# EAGLE design Laser_Array_Charging_board (EAGLE 7.7.0)
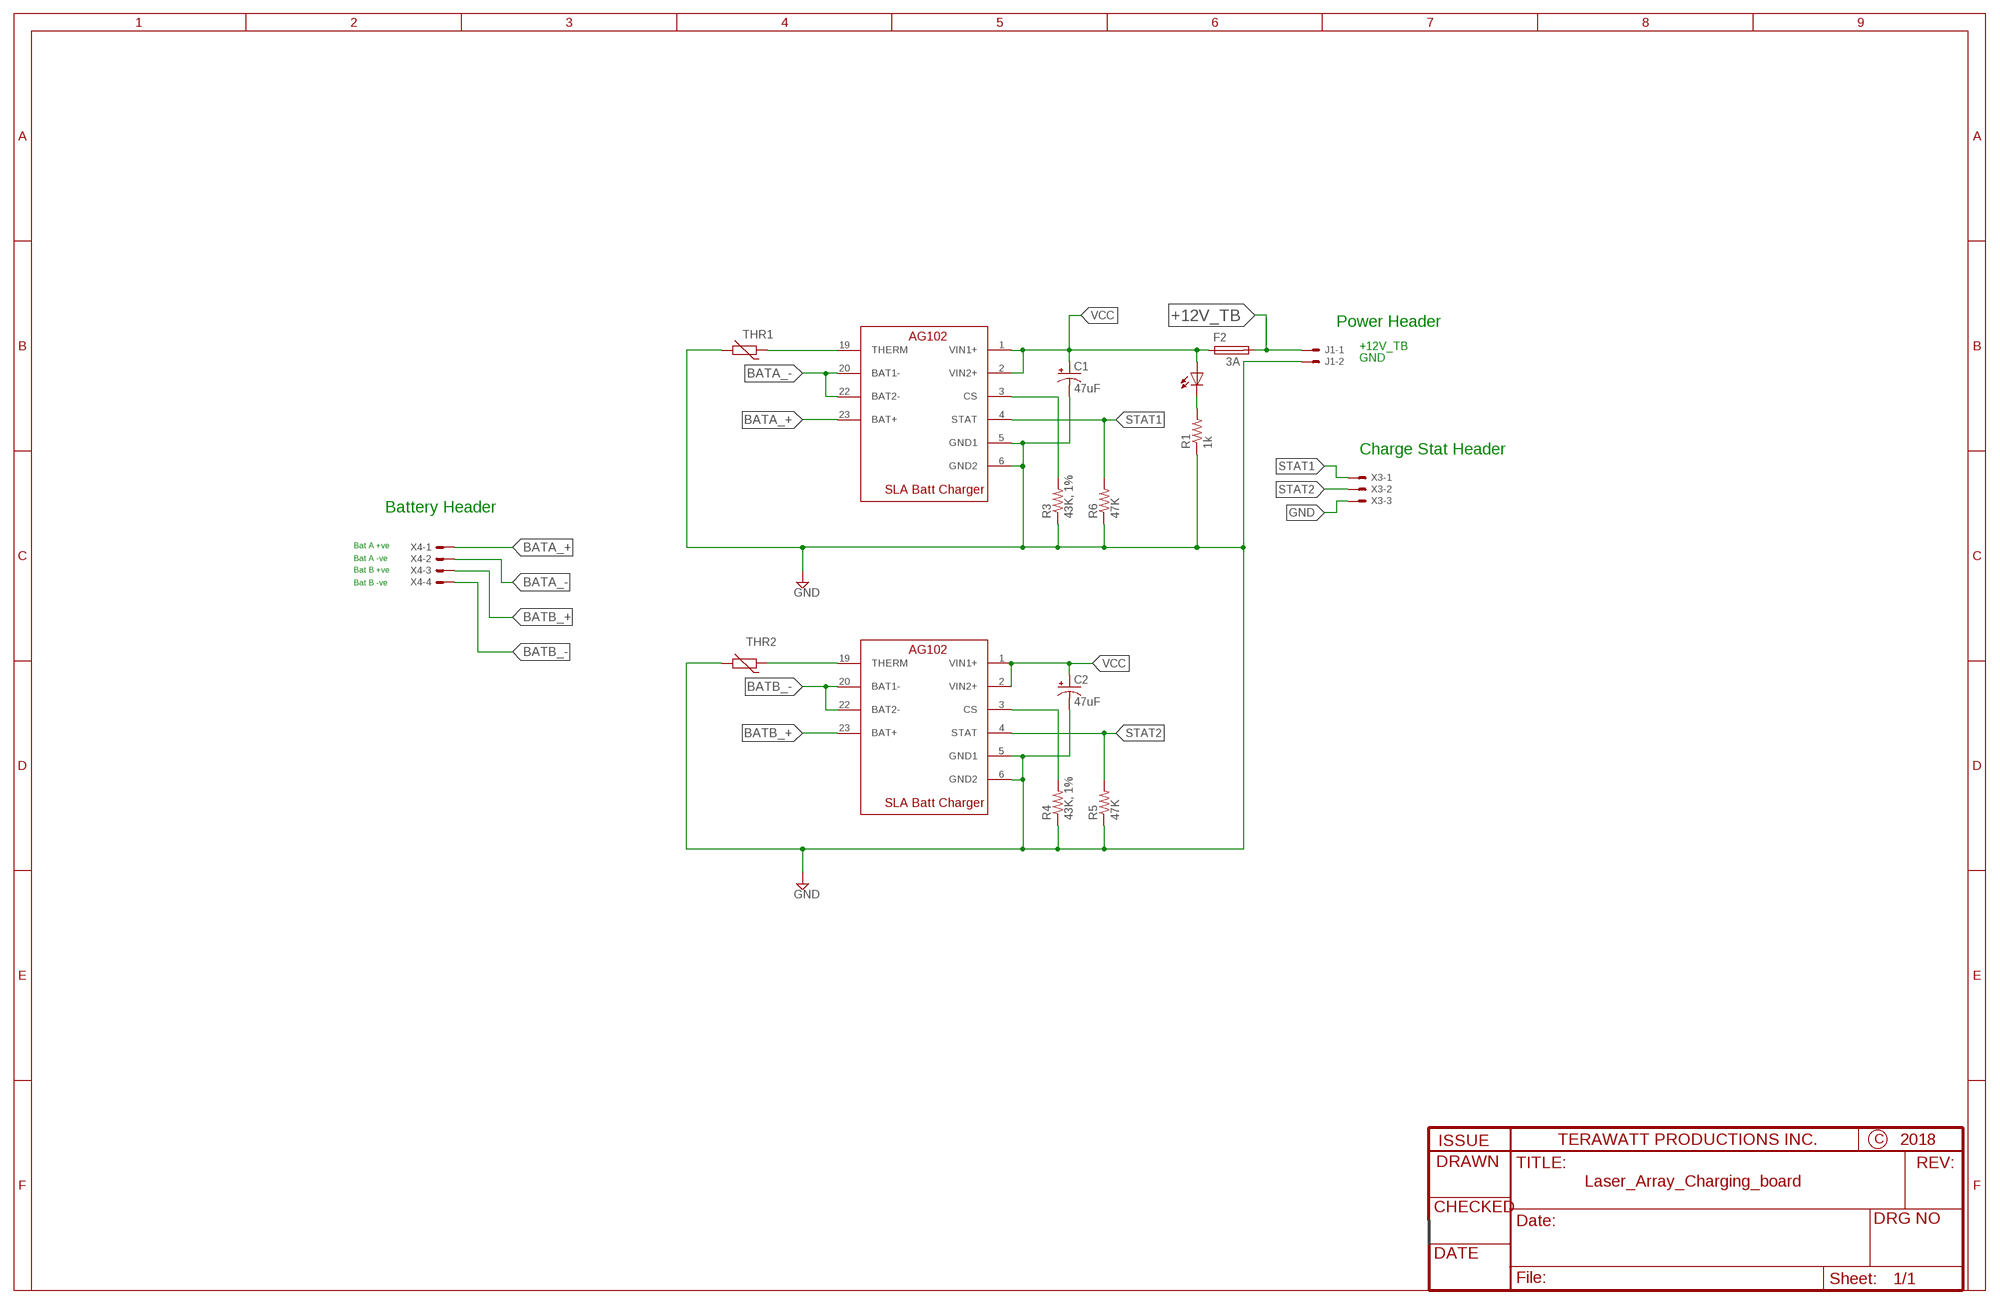
[diagram p0: schematic, sheet 1]

## Parts
C1  47uF  CPOL-USE5-10.5  [E5-10,5]
C2  47uF  CPOL-USE5-10.5  [E5-10,5]
CHG1  AG102_SLA_CHARGER  [SLA_CHARGER]
CHG2  AG102_SLA_CHARGER  [SLA_CHARGER]
F2  3A  SH22,5  [SH22,5]
J1  22-23-2021  [22-23-2021]
LED1  LEDCHIPLED_0805  [CHIPLED_0805]
R1  1k  R-US_M0805  [M0805]
R3  43K, 1%  R-US_R0805  [R0805]
R4  43K, 1%  R-US_R0805  [R0805]
R5  47K  R-US_R0805  [R0805]
R6  47K  R-US_R0805  [R0805]
THR1  THERMISTOR-2,5  [RS-2,5]
THR2  THERMISTOR-2,5  [RS-2,5]
X3  22-23-2031  [22-23-2031]
X4  22-23-2041  [22-23-2041]

## Nets
+12V_TB: F2.2 J1.1
BATA_+: CHG1.23(BAT+) X4.1
BATA_-: CHG1.20(BAT1-) CHG1.22(BAT2-) X4.2
BATB_+: CHG2.23(BAT+) X4.3
BATB_-: CHG2.20(BAT1-) CHG2.22(BAT2-) X4.4
GND: C1.- C2.- CHG1.5(GND1) CHG1.6(GND2) CHG2.5(GND1) CHG2.6(GND2) J1.2 R1.1 R3.1 R4.1 R5.1 R6.1 THR1.2 THR2.2 X3.3
N$1: CHG1.19(THERM) THR1.1
N$2: CHG2.19(THERM) THR2.1
N$3: LED1.C R1.2
N$7: CHG1.3(CS) R3.2
N$13: CHG2.3(CS) R4.2
STAT1: CHG1.4(STAT) R6.2 X3.1
STAT2: CHG2.4(STAT) R5.2 X3.2
VCC: C1.+ C2.+ CHG1.1(VIN1+) CHG1.2(VIN2+) CHG2.1(VIN1+) CHG2.2(VIN2+) F2.1 LED1.A

## Notes on the sheet
- Power Header
- +12V_TB
- GND
- Charge Stat Header
- Battery Header
- Bat A +ve
- Bat A -ve
- Bat B +ve
- Bat B -ve

## Library data of the parts
C1 C2 = Mine:CPOL-US: POLARIZED CAPACITOR, American symbol
CHG1 CHG2 = Mine:AG102_SLA_CHARGER
F2 = fuse:SH22,5: FUSE HOLDER grid 22,5 mm, OGN0031 8201, Schurter (Buerklin); MF: SCHURTER; MPN: 0031.8201; OC_FARNELL: 1162740; OC_NEWARK: 96F8317
J1 = Mine:22-23-2021: .100" (2.54mm) Center Header - 2 Pin; MF: MOLEX; MPN: 22-23-2021; OC_FARNELL: 1462926; OC_NEWARK: 25C3832
LED1 = Mine:LED: LED OSRAM: - CHIPLED LG R971, LG N971, LY N971, LG Q971, LY Q971, LO R971, LY R971 LH N974, LH R974 LS Q976, LO Q976, LY Q976 LO Q996 - Hyper CHIPLED LW Q18S LB Q993, LB Q99A, LB R99A - SideLED LS A670, LO A670, LY A670, LG A670, LP A670 LB A673, LV A673, LT A673, LW A673 LH A674 LY A675 LS A676, LA A676, LO A676, LY A676, LW A676 LS A679, LY A679, LG A679 - Hyper Micro SIDELED® LS Y876, LA Y876, LO Y876, LY Y876 LT Y87S - SmartLED LW L88C, LW L88S LB L89C, LB L89S, LG L890 LS L89K, LO L89K, LY L89K LS L896, LA L896, LO L896, LY L896 - TOPLED LS T670, LO T670, LY T670, LG T670, LP T670 LSG T670, LSP T670, LSY T670, LOP T670, LYG T670 LG T671, LOG T671, LSG T671 LB T673, LV T673, LT T673, LW T673 LH T674 LS T676, LA T676, LO T676, LY T676, LB T676, LH T676, LSB T676, LW T676 LB T67C, LV T67C, LT T67C, LS T67K, LO T67K, LY T67K, LW E67C LS E67B, LA E67B, LO E67B, LY E67B, LB E67C, LV E67C, LT E67C LW T67C LS T679, LY T679, LG T679 LS T770, LO T770, LY T770, LG T770, LP T770 LB T773, LV T773, LT T773, LW T773 LH T774 LS E675, LA E675, LY E675, LS T675 LS T776, LA T776, LO T776, LY T776, LB T776 LHGB T686 LT T68C, LB T68C - Hyper Mini TOPLED® LB M676 - Mini TOPLED Santana® LG M470 LS M47K, LO M47K, LY M47K Source: http://www.osram.convergy.de/
R1 R3-R6 = rcl:R-US_: RESISTOR, American symbol
THR1 THR2 = Mine:THERMISTOR: THERMISTOR
X3 = Mine:22-23-2031: .100" (2.54mm) Center Header - 3 Pin; MF: MOLEX; MPN: 22-23-2031; OC_FARNELL: 1462950; OC_NEWARK: 30C0862
X4 = Mine:22-23-2041: .100" (2.54mm) Center Header - 4 Pin; MF: MOLEX; MPN: 22-23-2041; OC_FARNELL: 1462920; OC_NEWARK: 38C0355

## Board
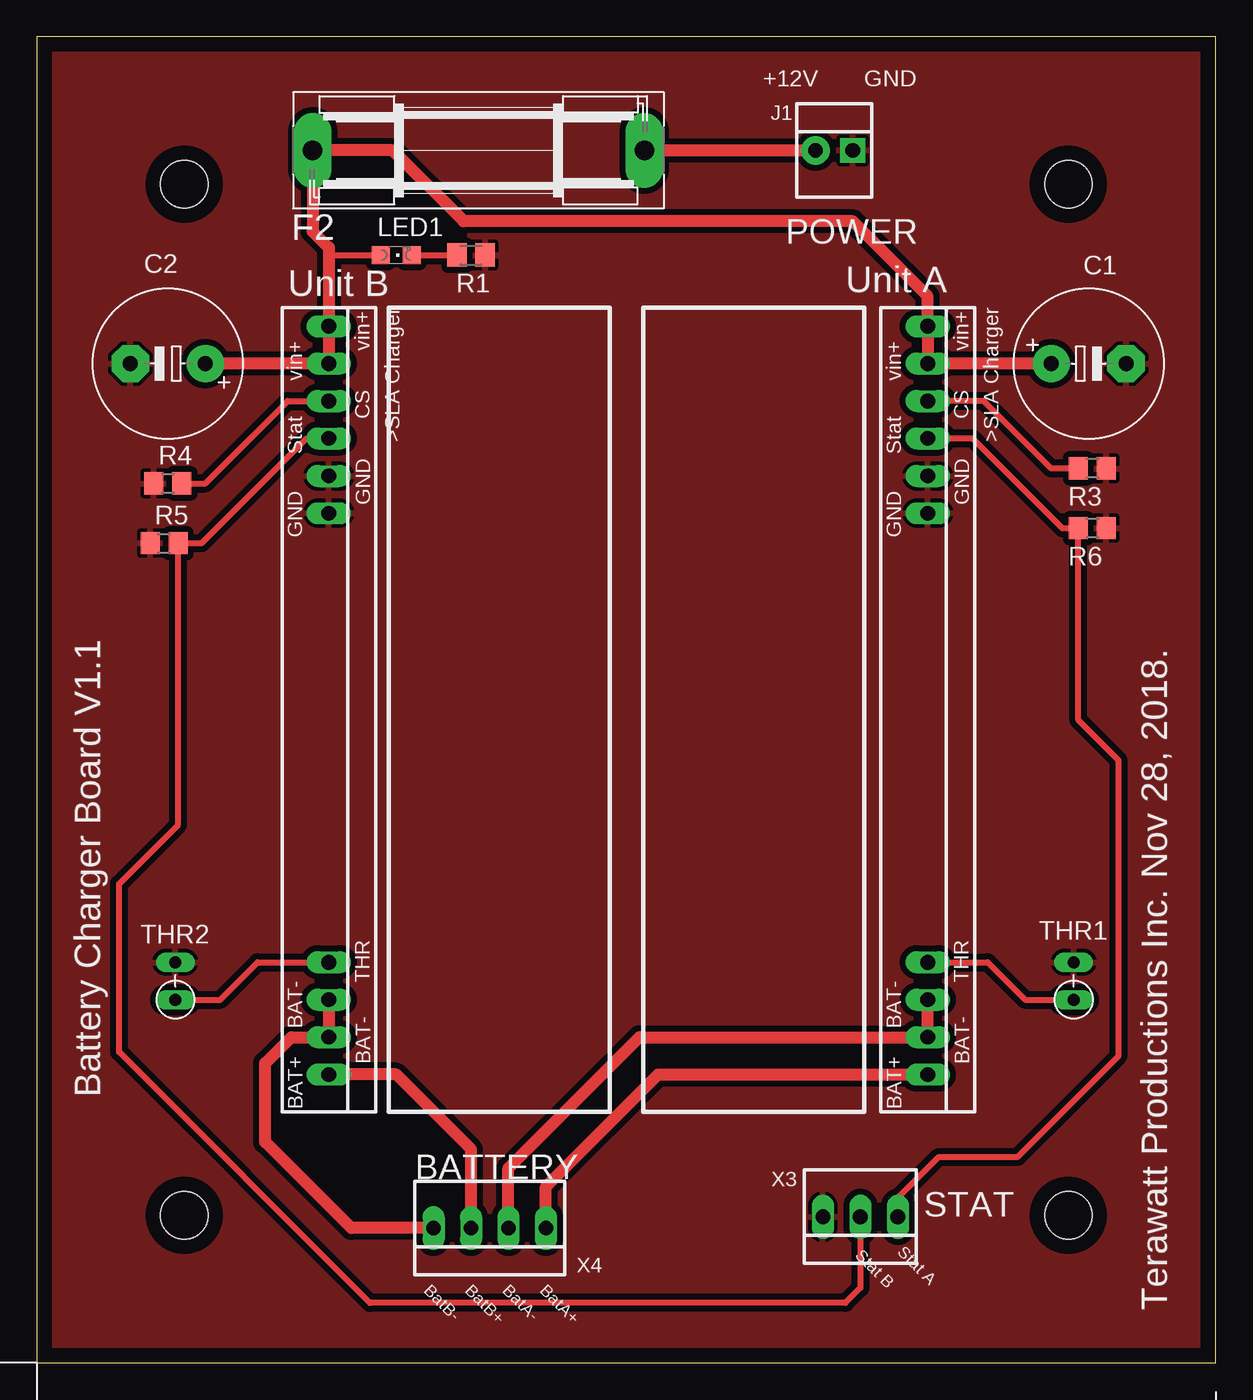
[diagram p1: board, top side]
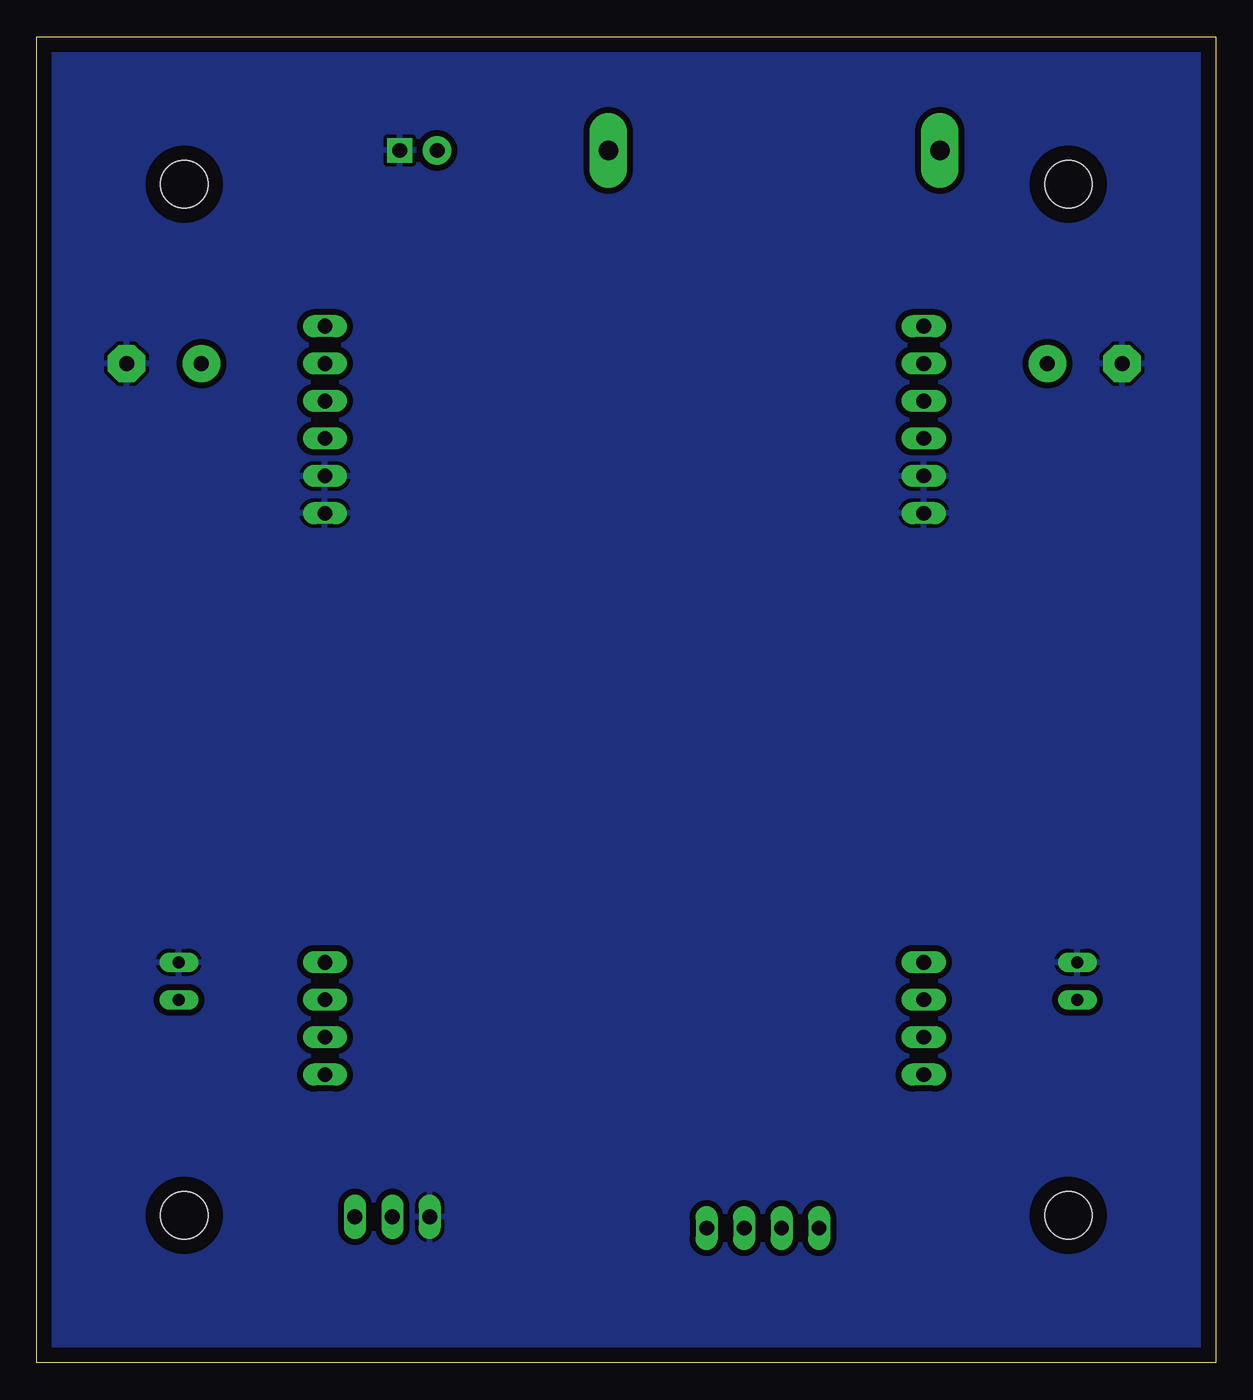
[diagram p2: board, bottom side, seen from below]

Size 80 x 90 mm. Coordinates in mm from the lower left corner, seen from the top.
Outline: 0,0 80,0 80,90 0,90 0,0
Copper layers (1*16): Top 0.035mm / dielectric 1.5mm / Bottom 0.035mm
Design rules "default *": minimum track width 10mil, minimum drill 24mil, track to track 16mil, track to pad 14mil, pad to pad 14mil, via to via 14mil, smd to smd 14mil, copper to edge 40mil, drill to drill 8mil, minimum pad ring 10mil, minimum via ring 8mil, stop-mask expansion 4mil, vias tented up to drill 0mil, thermal gap 10mil
Holes 3.2 mm at 10,10 70,10 70,80 10,80

### Footprints (pad centres in the part's own frame; a part is rotated, then mirrored left to right if it is on the bottom)
E5-10,5 = drill 1.016 pad 2.54: + -2.54,0 | drill 1.016 pad 2.54 octagon: - 2.54,0
SLA_CHARGER = drill 1 long: 1 -22.86,0; 2 -20.32,0; 3 -17.78,0; 4 -15.24,0; 5 -12.7,0; 6 -10.16,0; 19 20.32,0; 20 22.86,0; 22 25.4,0; 23 27.94,0
SH22,5 = drill 1.321 pad 2.54 long: 1 -11.252,0; 2 11.252,0
22-23-2021 = drill 1 pad 1.93: 1 -1.27,0 | drill 1 pad 1.676 square: 2 1.27,0
CHIPLED_0805 = smd 1.2 x 1.2: A 0,-1.05; C 0,1.05
M0805 = smd 1.3 x 1.6: 1 -0.95,0; 2 0.95,0
R0805 = smd 1.3 x 1.5: 1 -0.95,0; 2 0.95,0
RS-2,5 = drill 0.813 long: 1 -1.27,0; 2 1.27,0
22-23-2031 = drill 1 long: 1 -2.54,0; 2 0,0; 3 2.54,0
22-23-2041 = drill 1 long: 1 -3.81,0; 2 -1.27,0; 3 1.27,0; 4 3.81,0

### Placement (x,y rotation side)
C1  71.37,67.82 0 top
C2  8.89,67.82 180 top
CHG1  60.45,47.5 270 top
CHG2  19.81,47.5 270 top
F2  29.97,82.3 0 top
J1  54.1,82.3 0 top
LED1  24.38,75.18 270 top
R1  29.46,75.18 180 top
R3  71.63,60.71 180 top
R4  8.89,59.69 0 top
R5  8.64,55.63 0 top
R6  71.63,56.64 180 top
THR1  70.36,25.91 90 top
THR2  9.4,25.91 90 top
X3  55.88,9.91 180 top
X4  30.73,9.14 180 top

### Tracks (layer width: path | path; a pad name or v marks a point on that pad's centre or on a via)
+12V_TB
  Top 0.61: 41.22,82.2 F2.2
  Top 0.813: F2.2 J1.1
BATA_+
  Top 0.813: X4.1 34.54,11.94 42.16,19.56 CHG1.23
BATA_-
  Top 0.813: X4.2 32,13.21 40.89,22.1 CHG1.22 CHG1.20
BATB_+
  Top 0.813: X4.3 29.46,14.48 24.38,19.56 CHG2.23
BATB_-
  Top 0.813: CHG2.20 CHG2.22 17.27,22.1 15.49,20.32 15.49,14.99 21.34,9.14 X4.4
GND
  pour Top: 0,89.92 80.01,89.92 80.01,0 0,0
  pour Bottom: 0,89.92 80.01,89.92 80.01,0 0,0
N$1
  Top 0.406: CHG1.19 64.52,27.18 67.06,24.64 THR1.1
N$2
  Top 0.406: THR2.1 12.45,24.64 14.99,27.18 CHG2.19
N$3
  Top 0.406: LED1.C R1.2
N$7
  Top 0.406: R3.2 68.83,60.71 64.26,65.28 CHG1.3
N$13
  Top 0.406: R4.2 11.43,59.69 17.02,65.28 CHG2.3
STAT1
  Top 0.406: X3.1 58.42,11.18 61.21,13.97 66.55,13.97 73.41,20.83 73.41,40.89 70.68,43.62 R6.2 69.6,56.64 63.5,62.74 CHG1.4
STAT2
  Top 0.406: CHG2.4 18.29,62.74 11.18,55.63 R5.2 9.59,36.51 5.59,32.51 5.59,21.08 22.61,4.06 54.86,4.06 55.88,5.08 X3.2
VCC
  Top 0.406: 19.81,75.18 LED1.A
  Top 0.813: C2.+ CHG2.2 CHG2.1 19.81,75.18 19.81,75.69 18.72,76.78 F2.1 24.13,82.3 28.96,77.47 55.37,77.47 60.45,72.39 CHG1.1 CHG1.2 C1.+

### Text on the board
tPlace: +12V | GND | POWER | Unit A | Unit B | Battery Charger Board V1.1 | BATTERY | STAT | Stat B | Stat A | BatB- | BatB+ | BatA- | BatA+ | Terawatt Productions Inc. Nov 28, 2018.